# Altium project Nova_34.PrjPcb
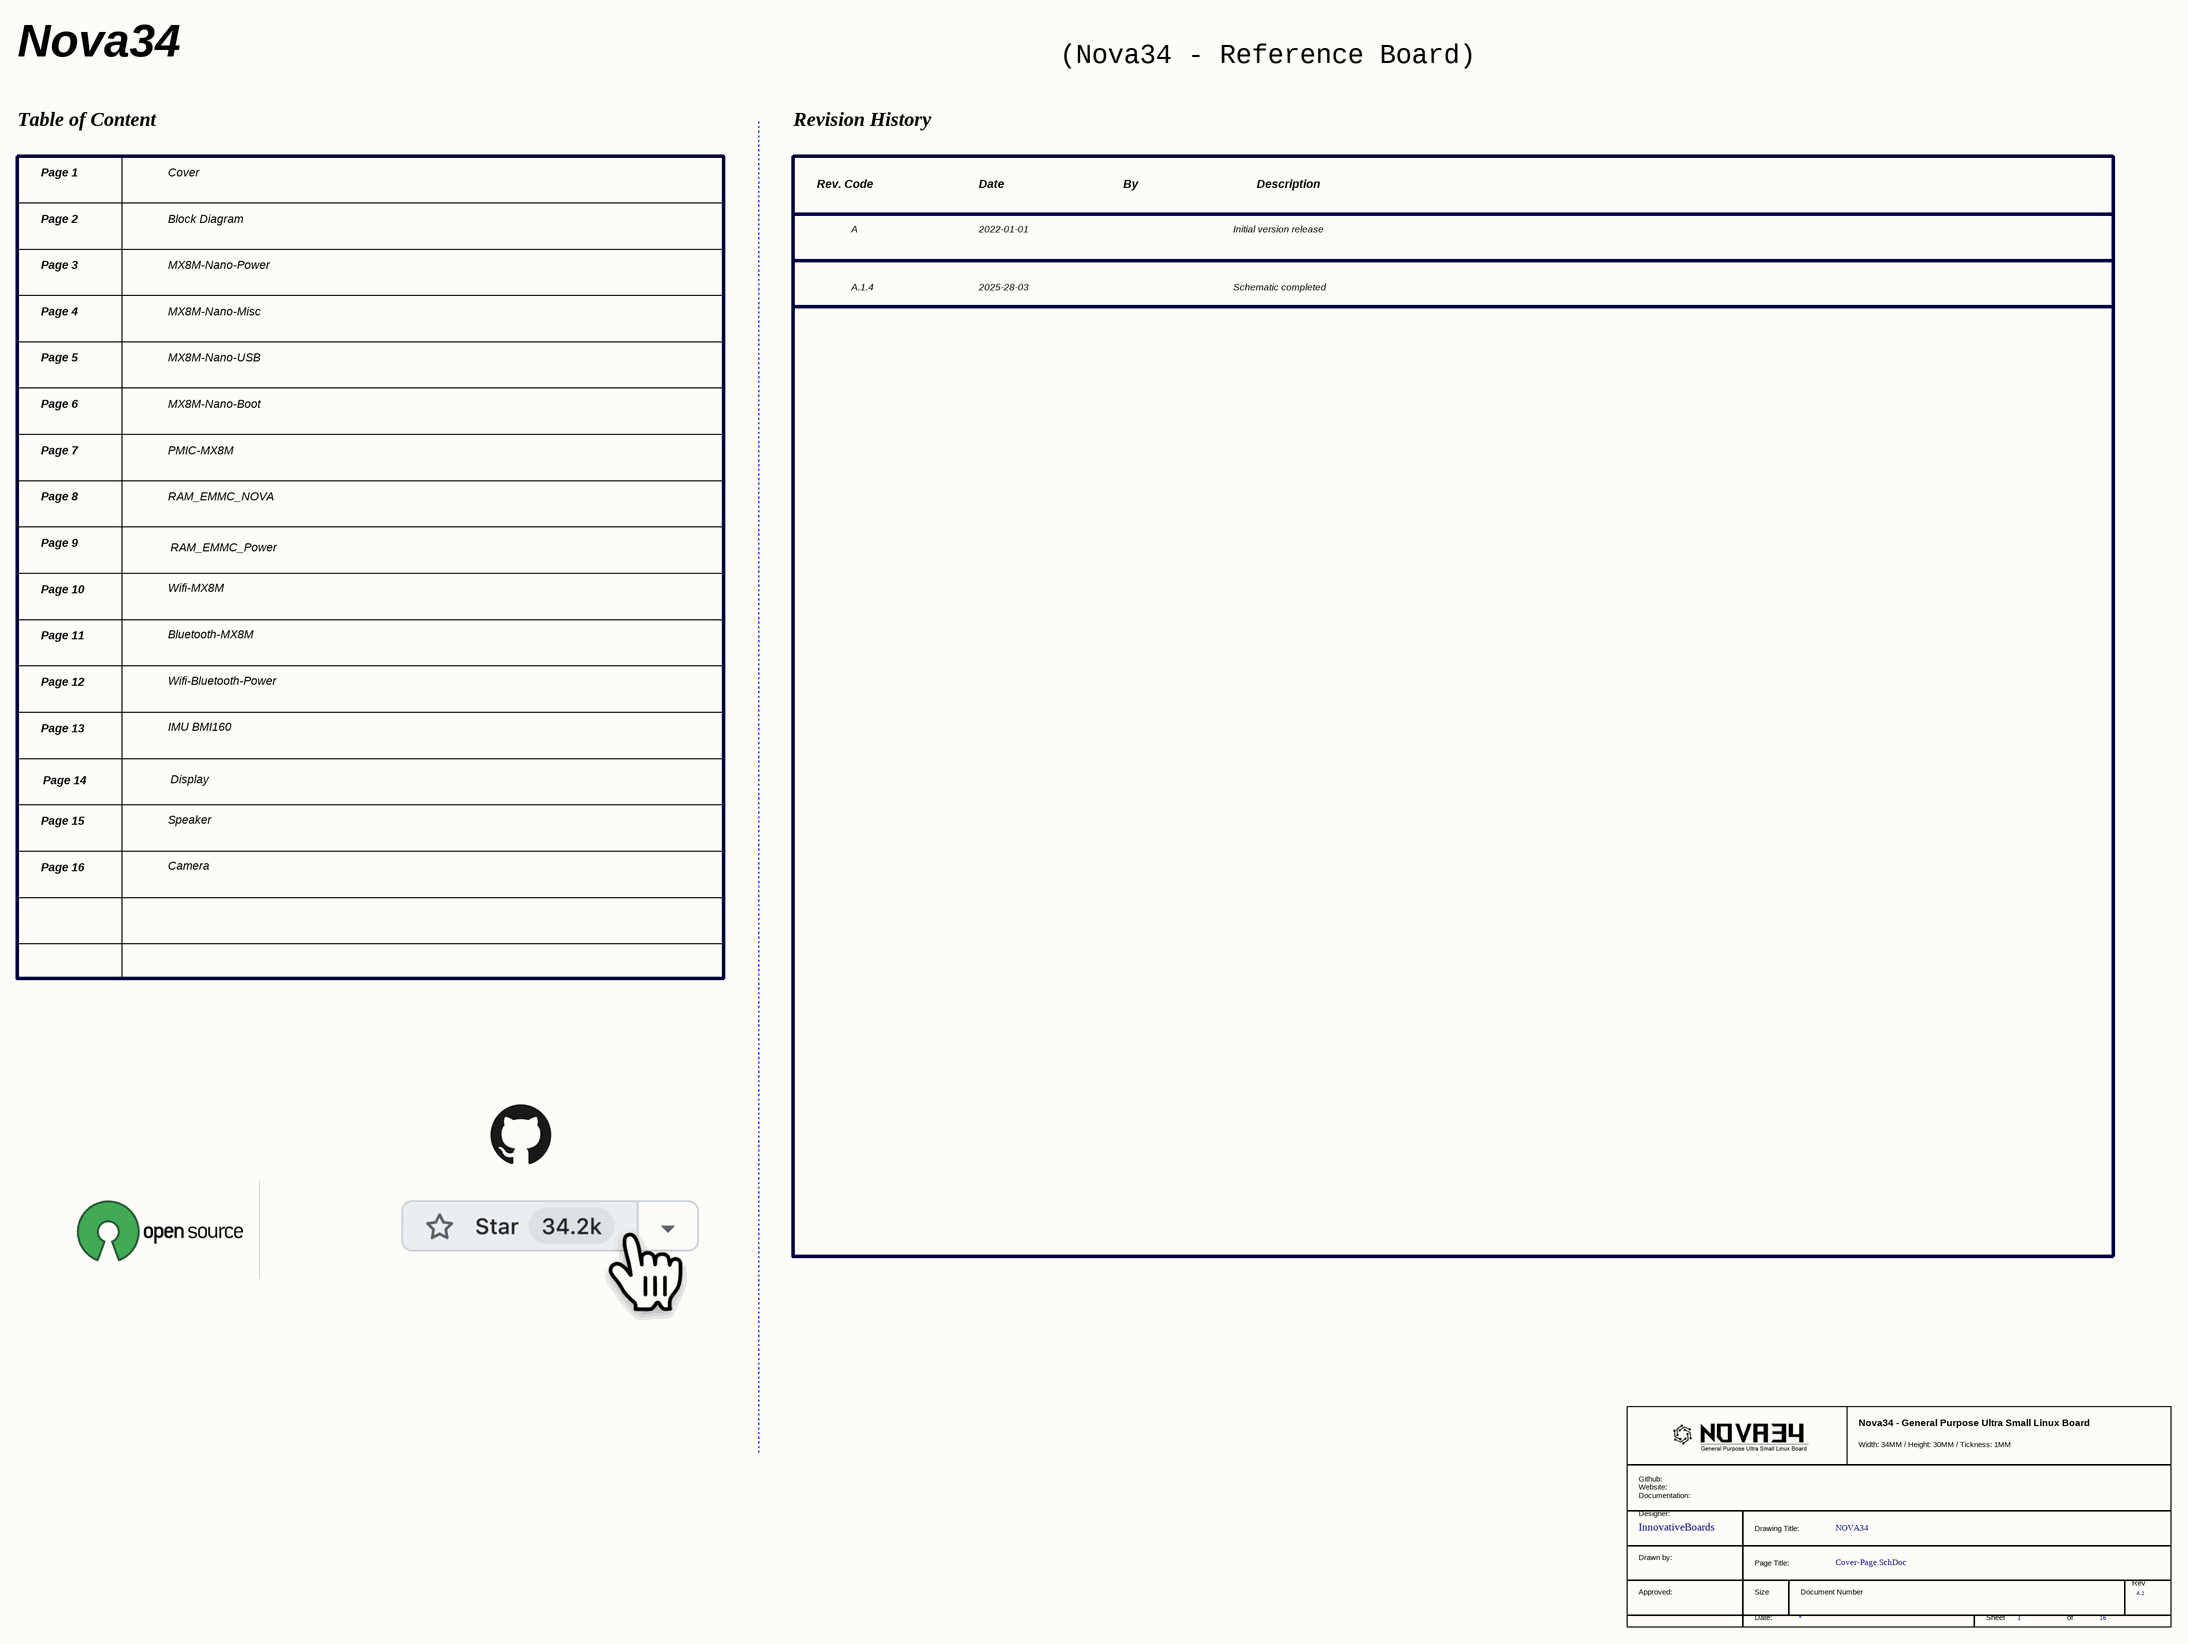
[diagram p0: Cover-Page.SchDoc]
6 sheets, 73 parts. Net scope: global (net labels, ports and power ports of the same name join across sheets).
Board file: Nova_PCB_Prod.PcbDoc
Sheets:
  Cover-Page.SchDoc
  MX8M-Nano-USB.SchDoc
  PMIC-MX8M.SchDoc
  RAM_EMMC_NOVA.SchDoc
  Wifi-MX8M.SchDoc
  Wifi-Bluetooth-Power.SchDoc

## Sheet Cover-Page.SchDoc
size C; SheetNumber: 1; SheetTotal: 16

### Parts
(Parts that share a designator on the sheet are numbered #1, #2 ... from top to bottom, then left to right.)
*#1  RevCode: A.2  (hidden comment: TitleBlock_MCPG)  (graphical)

### Notes on the sheet
- Nova34
- (Nova34 - Reference Board)
- Table of Content
- Page 1
- Cover
- Revision History
- Page 2
- Block Diagram
- Rev. Code
- A
- Date
- 2022-01-01
- By
- Initial version release
- Description
- Page 3
- MX8M-Nano-Power
- A.1.4
- 2025-28-03
- Schematic completed
- Page 4
- MX8M-Nano-Misc
- Page 5
- Page 6
- MX8M-Nano-USB
- MX8M-Nano-Boot
- Page 7
- PMIC-MX8M
- Page 8
- RAM_EMMC_NOVA
- Page 9
- RAM_EMMC_Power
- Page 10
- Page 11
- Wifi-MX8M
- Bluetooth-MX8M
- Page 12
- Wifi-Bluetooth-Power
- Page 13
- IMU BMI160
- Page 14
- Display
- Page 15
- Page 16
- Speaker
- Camera
- (in symbol TitleBlock_MCPG) Nova34 - General Purpose Ultra Small Linux Board; Width: 34MM / Height: 30MM / Tickness: 1MM; Github: / Website: / Documentation:; Designer:; InnovativeBoards; Drawing Title:; NOVA34; Drawn by:; Page Title:; Rev; Approved:; Size; Document Number; Date:; Sheet; of

### Library data of the parts
*#1 = TitleBlock_MCPG: Page Create Date: March  8, 1995

## Sheet MX8M-Nano-USB.SchDoc
size A; SheetNumber: 5; SheetTotal: 15
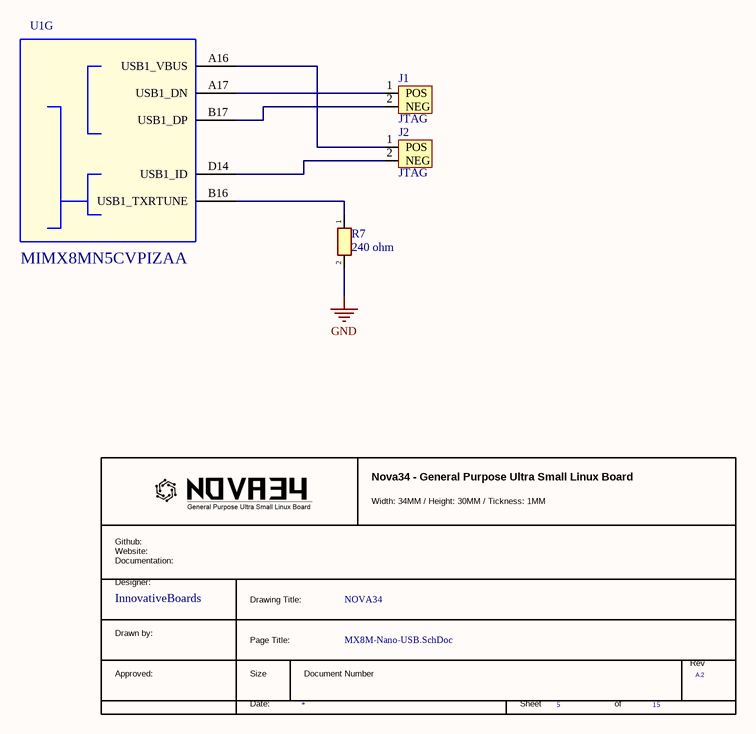
[diagram p1: MX8M-Nano-USB.SchDoc]

### Parts
(Parts that share a designator on the sheet are numbered #1, #2 ... from top to bottom, then left to right.)
*#2  RevCode: A.2  (hidden comment: TitleBlock_MCPG)  (graphical)
J1  JTAG  [JTAG]
J2  JTAG  [JTAG]
R7  240 ohm  [RESC0603X26N]
U1  MIMX8MN5CVPIZAA  [BGA306C50P21X21_1100X1100X101]  (part G of 12)

### Nets
GND: R7.2
NetJ1_1: J1.1(POS) U1.A17(USB1_DN)
NetJ1_2: J1.2(NEG) U1.B17(USB1_DP)
NetJ2_1: J2.1(POS) U1.A16(USB1_VBUS)
NetJ2_2: J2.2(NEG) U1.D14(USB1_ID)
NetR7_1: R7.1 U1.B16(USB1_TXRTUNE)

### Notes on the sheet
- (in symbol TitleBlock_MCPG) Nova34 - General Purpose Ultra Small Linux Board; Width: 34MM / Height: 30MM / Tickness: 1MM; Github: / Website: / Documentation:; Designer:; InnovativeBoards; Drawing Title:; NOVA34; Drawn by:; Page Title:; Rev; Approved:; Size; Document Number; Date:; Sheet; of

### Library data of the parts
R7 = RC0201FR-07240RL: Resistor; Manufacturer_Name: KEMET; Datasheet Link: http://www.yageo.com/documents/recent/PYu-RC0201_51_RoHS_L_8.pdf; Height: 0.26mm; Manufacturer_Part_Number: RC0201FR-07240RL; Mouser Part Number: 603-RC0201FR-07240RL; Mouser Price/Stock: http://www.mouser.com/Search/ProductDetail.aspx?qs=qUsL5DZkYVqW175bPUdS2w%3d%3d; Arrow Part Number: RC0201FR-07240RL; Arrow Price/Stock: https://www.arrow.com/en/products/rc0201fr-07240rl/yageo
U1 = MIMX8MN: IC CPU QUAD CORTEX A53+M7 1.4GHZ -- BGA306; PCB Footprint: pbga306_0p5_sq11mm; AGILE_PN: TMP-CIP-5098; CAD_APPROVED: Yes; PRE_APN: 330-77152; Temp Range: -40¡ãC to 105¡ãC; MFG_NAME01: NXP SEMICONDUCTORS; CLASS: IC; HEIGHT: 1.01MM; ROHS: Yes; MFG_PN01: MIMX8MN5CVPIZAA
*#2 = TitleBlock_MCPG: Page Create Date: March  8, 1995

## Sheet PMIC-MX8M.SchDoc
size A2; SheetNumber: 7; SheetTotal: 15
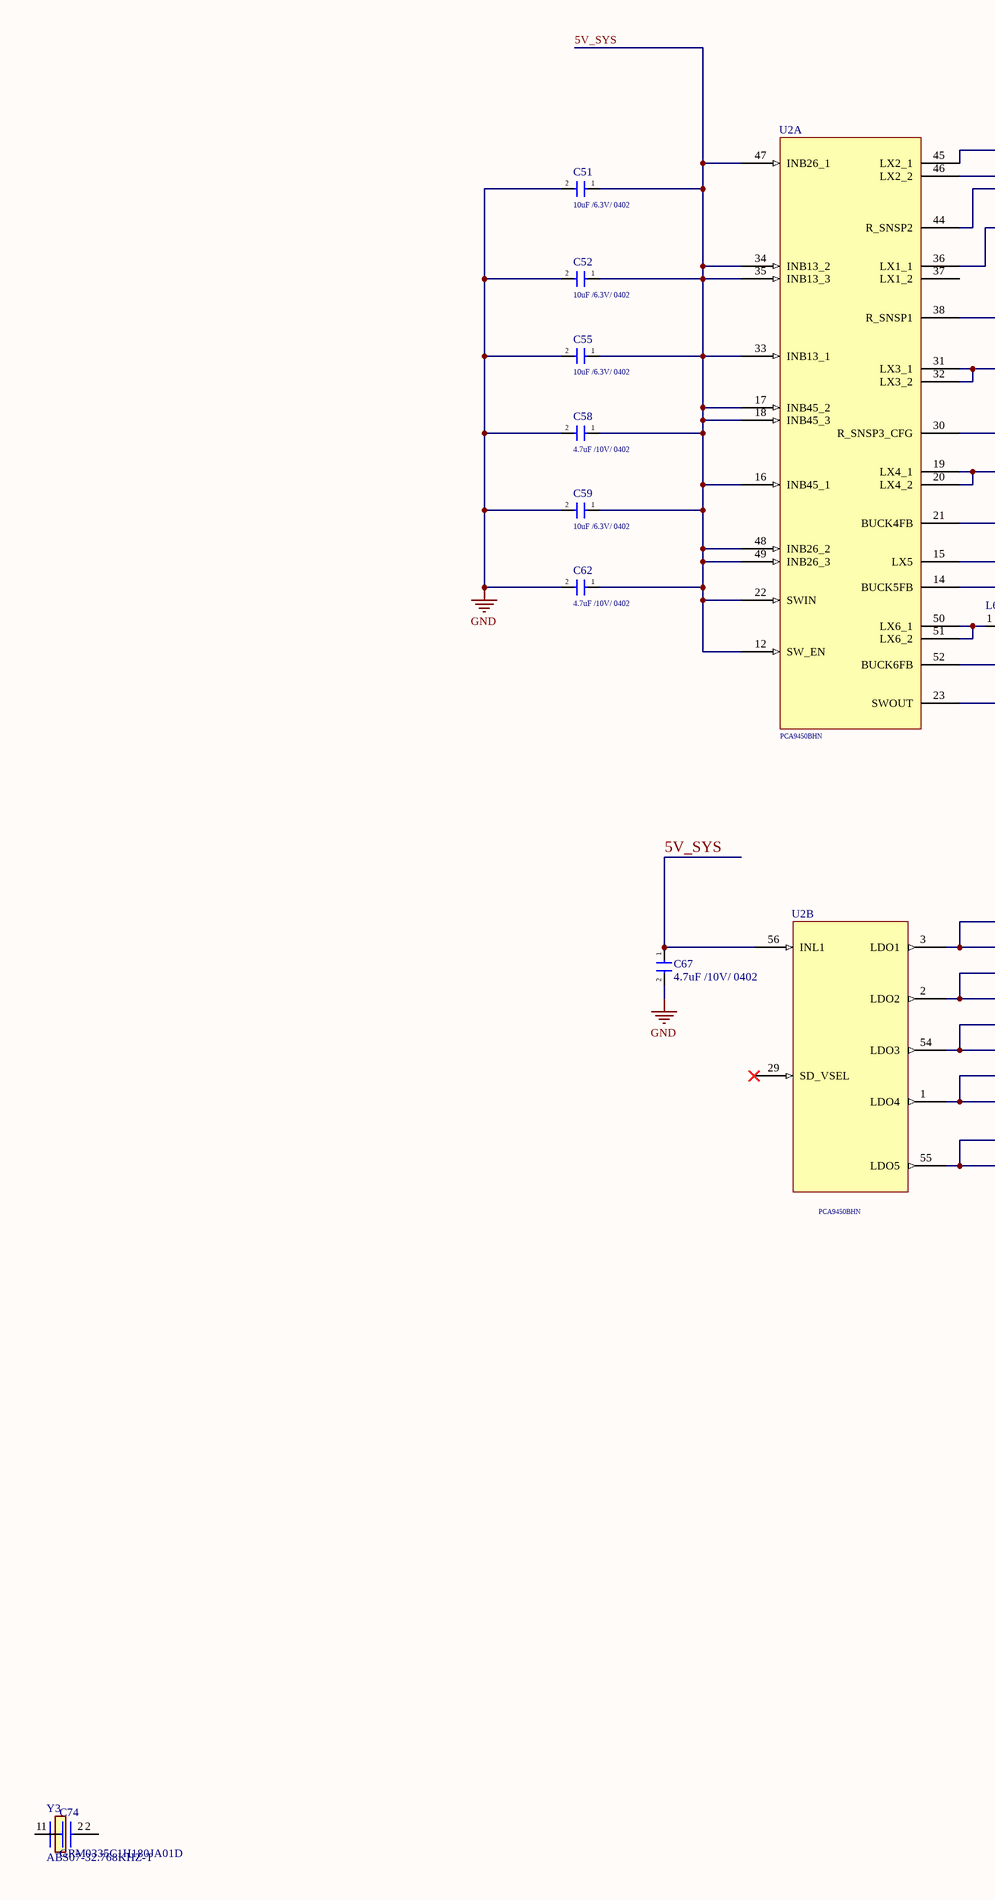
[diagram p2: PMIC-MX8M.SchDoc, left]
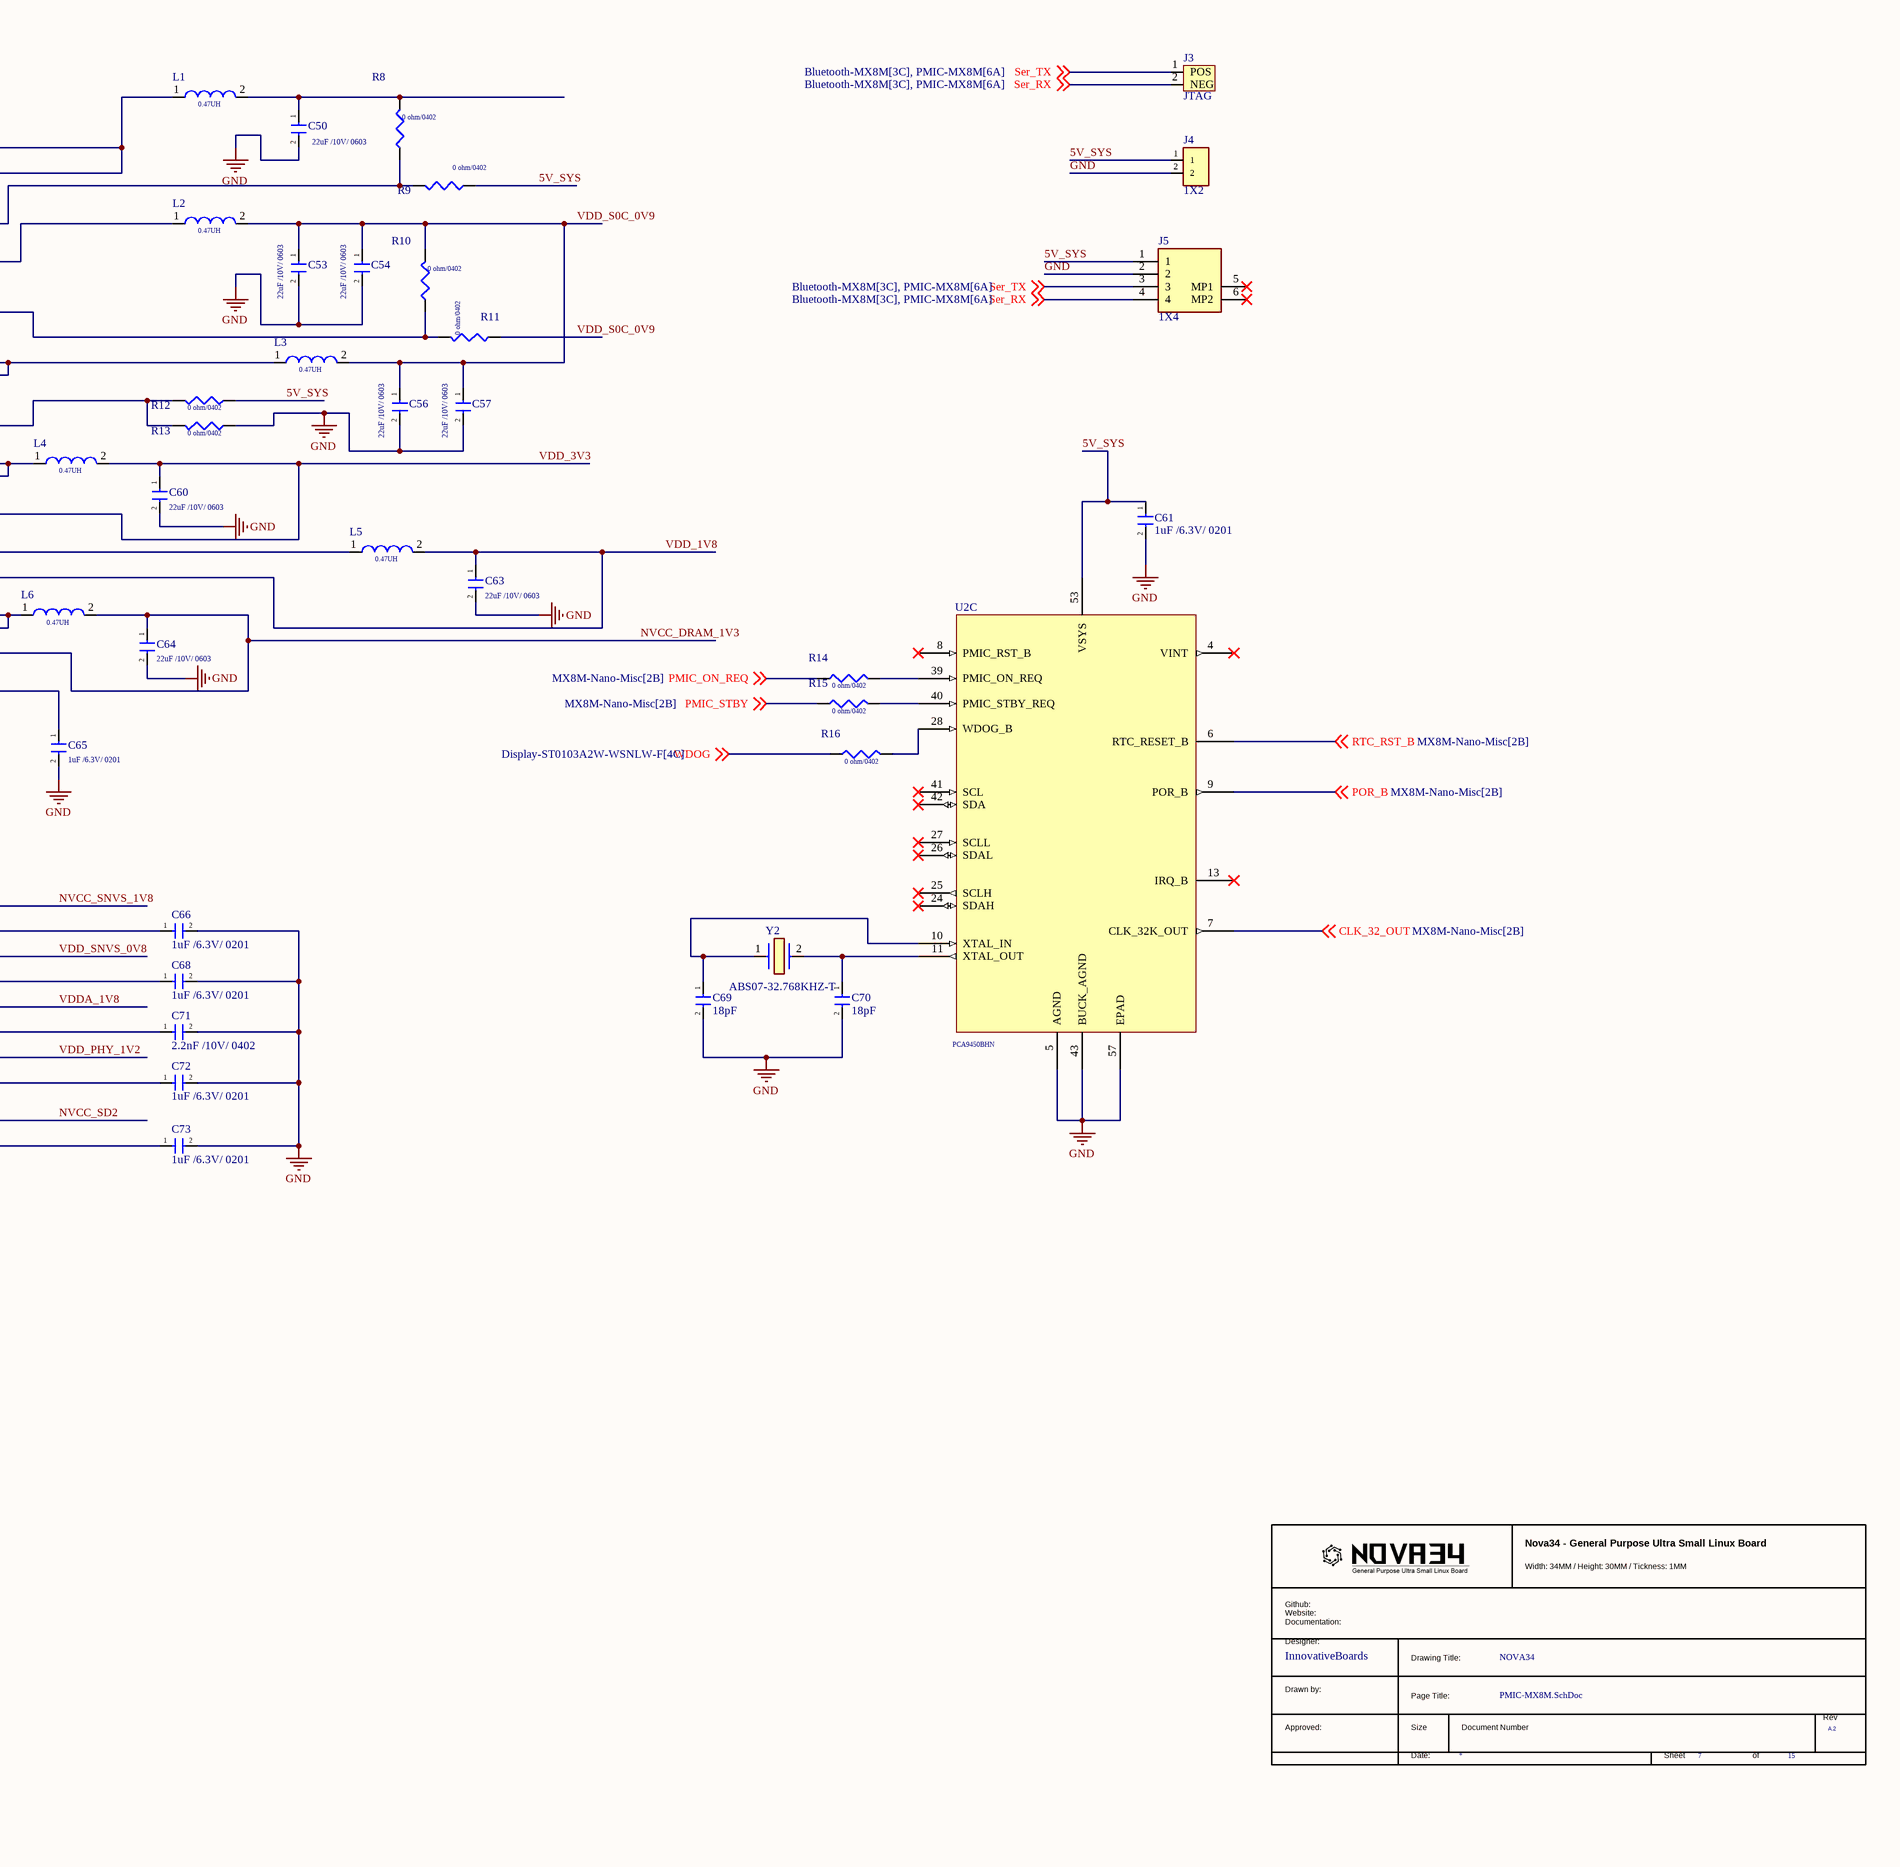
[diagram p3: PMIC-MX8M.SchDoc, right]

### Parts
(Parts that share a designator on the sheet are numbered #1, #2 ... from top to bottom, then left to right.)
*#3  RevCode: A.2  (hidden comment: TitleBlock_MCPG)  (graphical)
C50  22uF /10V/ 0603  [GRM18x]
C51  10uF /6.3V/ 0402  [CAPC1005X65N]
C52  10uF /6.3V/ 0402  [CAPC1005X65N]
C53  22uF /10V/ 0603  [GRM18x]
C54  22uF /10V/ 0603  [GRM18x]
C55  10uF /6.3V/ 0402  [CAPC1005X65N]
C56  22uF /10V/ 0603  [GRM18x]
C57  22uF /10V/ 0603  [GRM18x]
C58  4.7uF /10V/ 0402  [CAPC1005X70N]
C59  10uF /6.3V/ 0402  [CAPC1005X65N]
C60  22uF /10V/ 0603  [GRM18x]
C61  1uF /6.3V/ 0201  [GRM033D70J224ME01D]
C62  4.7uF /10V/ 0402  [CAPC1005X70N]
C63  22uF /10V/ 0603  [GRM18x]
C64  22uF /10V/ 0603  [GRM18x]
C65  1uF /6.3V/ 0201  [GRM033D70J224ME01D]
C66  1uF /6.3V/ 0201  [GRM033D70J224ME01D]
C67  4.7uF /10V/ 0402  [CAPC1005X70N]
C68  1uF /6.3V/ 0201  [GRM033D70J224ME01D]
C69  18pF  [CAPC0603X33N]
C70  18pF  [CAPC0603X33N]
C71  2.2nF /10V/ 0402  [CAPC1005X70N]
C72  1uF /6.3V/ 0201  [GRM033D70J224ME01D]
C73  1uF /6.3V/ 0201  [GRM033D70J224ME01D]
C74  GRM0335C1H180JA01D  [CAPC0603X33N]
J3  JTAG  [JTAG]
J4  1X2  [HDRV2W64P0X254_1X2_508X254X838P]
J5  1X4  [B4BZRSM4TFLFSN]
L1  0.47UH  [IND_SPH2520]
L2  0.47UH  [IND_SPH2520]
L3  0.47UH  [IND_SPH2520]
L4  0.47UH  [IND_SPH2520]
L5  0.47UH  [IND_SPH2520]
L6  0.47UH  [IND_SPH2520]
R8  0 ohm/0402  [RES_0402]
R9  0 ohm/0402  [RES_0402]
R10  0 ohm/0402  [RES_0402]
R11  0 ohm/0402  [RES_0402]
R12  0 ohm/0402  [RES_0402]
R13  0 ohm/0402  [RES_0402]
R14  0 ohm/0402  [RES_0402]
R15  0 ohm/0402  [RES_0402]
R16  0 ohm/0402  [RES_0402]
U2  PCA9450BHN  [QFN40P700X700X100-57N-D]  (parts A,B,C of 3)
Y2  ABS07-32.768KHZ-T  [ABS07]
Y3  ABS07-32.768KHZ-T  [ABS07]

### Nets
GND: C50.2 C51.2 C52.2 C53.2 C54.2 C55.2 C56.2 C57.2 C58.2 C59.2 C60.2 C61.2 C62.2 C63.2 C64.2 C65.2 C66.2 C67.2 C68.2 C69.2 C70.2 C71.2 C72.2 C73.2 J4.2 J5.2 R13.1 U2.5(AGND) U2.43(BUCK_AGND) U2.57(EPAD)
5V_SYS: C51.1 C52.1 C55.1 C58.1 C59.1 C61.1 C62.1 C67.1 J4.1 J5.1 R9.1 R12.1 U2.12(SW_EN) U2.16(INB45_1) U2.17(INB45_2) U2.18(INB45_3) U2.22(SWIN) U2.33(INB13_1) U2.34(INB13_2) U2.35(INB13_3) U2.47(INB26_1) U2.48(INB26_2) U2.49(INB26_3) U2.53(VSYS) U2.56(INL1)
CLK_32_OUT: U2.7(CLK_32K_OUT) ; off-sheet CLK_32_OUT
NVCC_DRAM_1V3: C64.1 L6.2 U2.52(BUCK6FB)
NVCC_SD2: C73.1 U2.55(LDO5)
NVCC_SNVS_1V8: C66.1 U2.3(LDO1)
PMIC_ON_REQ: R14.1 ; off-sheet PMIC_ON_REQ
PMIC_STBY: R15.1 ; off-sheet PMIC_STBY
POR_B: U2.9(POR_B) ; off-sheet POR_B
RTC_RST_B: U2.6(RTC_RESET_B) ; off-sheet RTC_RST_B
Ser_RX: J3.2(NEG) J5.4 ; off-sheet Ser_RX
Ser_TX: J3.1(POS) J5.3 ; off-sheet Ser_TX
VDD_1V8: C63.1 L5.2 U2.14(BUCK5FB)
VDD_3V3: C60.1 L4.2 U2.21(BUCK4FB)
VDD_PHY_1V2: C72.1 U2.1(LDO4)
VDD_S0C_0V9: C53.1 C54.1 C56.1 C57.1 L2.2 L3.2 R10.2 R11.1
VDD_SNVS_0V8: C68.1 U2.2(LDO2)
VDDA_1V8: C71.1 U2.54(LDO3)
WDOG: R16.1 ; off-sheet WDOG
NetC50_1: C50.1 L1.2 R8.2
NetC65_1: C65.1 U2.23(SWOUT)
NetC69_1: C69.1 U2.10(XTAL_IN) Y2.1
NetC70_1: C70.1 U2.11(XTAL_OUT) Y2.2
NetC74_1: C74.1 Y3.1
NetL1_1: L1.1 U2.45(LX2_1) U2.46(LX2_2)
NetL2_1: L2.1 U2.36(LX1_1)
NetL3_1: L3.1 U2.31(LX3_1) U2.32(LX3_2)
NetL4_1: L4.1 U2.19(LX4_1) U2.20(LX4_2)
NetL5_1: L5.1 U2.15(LX5)
NetL6_1: L6.1 U2.50(LX6_1) U2.51(LX6_2)
NetR8_1: R8.1 R9.2 U2.44(R_SNSP2)
NetR10_1: R10.1 R11.2 U2.38(R_SNSP1)
NetR12_2: R12.2 R13.2 U2.30(R_SNSP3_CFG)
NetR14_2: R14.2 U2.39(PMIC_ON_REQ)
NetR15_2: R15.2 U2.40(PMIC_STBY_REQ)
NetR16_2: R16.2 U2.28(WDOG_B)

Not connected (* = marked no-connect by the designer): C74 2; J5 5(MP1)* 6(MP2)*; U2 4(VINT)* 8(PMIC_RST_B)* 13(IRQ_B)* 24(SDAH)* 25(SCLH)* 26(SDAL)* 27(SCLL)* 29(SD_VSEL)* 37(LX1_2) 41(SCL)* 42(SDA)*; Y3 2

### Notes on the sheet
- (in symbol TitleBlock_MCPG) Nova34 - General Purpose Ultra Small Linux Board; Width: 34MM / Height: 30MM / Tickness: 1MM; Github: / Website: / Documentation:; Designer:; InnovativeBoards; Drawing Title:; NOVA34; Drawn by:; Page Title:; Rev; Approved:; Size; Document Number; Date:; Sheet; of

### Library data of the parts
C50 C53 C54 C56 C57 C60 C63 C64 = GRM187R61A226ME15D: Multilayer Ceramic Capacitors MLCC - SMD/SMT 22 uF 10 VDC 20% 0603 X5R; Manufacturer_Name: Murata Electronics; Datasheet Link: https://search.murata.co.jp/Ceramy/image/img/A01X/G101/ENG/GRM187R61A226ME15-01A.pdf; Height: 0.9mm; Manufacturer_Part_Number: GRM187R61A226ME15D; Mouser Part Number: 81-GRM187R61A226ME5D; Mouser Price/Stock: https://www.mouser.co.uk/ProductDetail/Murata-Electronics/GRM187R61A226ME15D?qs=I53XXhTNm8uUaeh8Eawx4Q%3D%3D; Arrow Part Number: GRM187R61A226ME15D; Arrow Price/Stock: https://www.arrow.com/en/products/grm187r61a226me15d/murata-manufacturing?region=nac
C51 C52 C55 C59 = GRM155R60J106ME15D: Multilayer Ceramic Capacitors MLCC - SMD/SMT 10 uF 6.3 VDC 20% 0402 X5R; Manufacturer_Name: Murata Electronics; Datasheet Link: https://search.murata.co.jp/Ceramy/image/img/A01X/G101/ENG/GRM155R60J106ME15-01A.pdf; Height: 0.65mm; Manufacturer_Part_Number: GRM155R60J106ME15D; Mouser Part Number: 81-GRM155R60J106ME5D; Mouser Price/Stock: https://www.mouser.co.uk/ProductDetail/Murata-Electronics/GRM155R60J106ME15D?qs=I53XXhTNm8s65u6%252BR3mHqw%3D%3D; Arrow Part Number: GRM155R60J106ME15D; Arrow Price/Stock: https://www.arrow.com/en/products/grm155r60j106me15d/murata-manufacturing?region=nac
C58 C62 C67 = GRT155C81A475ME13J: Multilayer Ceramic Capacitors MLCC - SMD/SMT 0402 X6S 4.7 F 20 10VDC AEC-Q200; Manufacturer_Name: Murata Electronics; Datasheet Link: https://search.murata.co.jp/Ceramy/image/img/A01X/G101/ENG/GRT155C81A475ME13-01A.pdf; Height: 0.7mm; Manufacturer_Part_Number: GRT155C81A475ME13J; Mouser Part Number: 81-GRT155C81A475ME3J; Mouser Price/Stock: https://www.mouser.co.uk/ProductDetail/Murata-Electronics/GRT155C81A475ME13J?qs=ufv2HEpFn%252BS%252BPUDm1eQCHw%3D%3D
C61 C65 C66 C68 C72 C73 = GRM033C80J105ME05J: Multilayer Ceramic Capacitors MLCC - SMD/SMT 1 uF 6.3 VDC 20% 0201 X6S; Manufacturer_Name: Murata Electronics; Datasheet Link: https://search.murata.co.jp/Ceramy/image/img/A01X/G101/ENG/GRM033C80J105ME05-01A.pdf; Height: 0.33mm; Manufacturer_Part_Number: GRM033C80J105ME05J; Mouser Part Number: 81-GRM033C80J105ME5J; Mouser Price/Stock: https://www.mouser.co.uk/ProductDetail/Murata-Electronics/GRM033C80J105ME05J?qs=5aG0NVq1C4we89LuRh7HJA%3D%3D; Arrow Part Number: GRM033C80J105ME05J; Arrow Price/Stock: https://www.arrow.com/en/products/grm033c80j105me05j/murata-manufacturing?region=nac
C69 C70 C74 = GRM0335C1H180JA01D: Capacitor; Manufacturer_Name: Murata Electronics; Datasheet Link: https://search.murata.co.jp/Ceramy/image/img/A01X/G101/ENG/GRM0335C1H180JA01-01A.pdf; Height: 0.33mm; Manufacturer_Part_Number: GRM0335C1H180JA01D; Mouser Part Number: 81-GRM0335C1H180JA1D; Mouser Price/Stock: https://www.mouser.co.uk/ProductDetail/Murata-Electronics/GRM0335C1H180JA01D?qs=lsk7mV%2FgRRLtYG1v2rvE9A%3D%3D; Arrow Part Number: GRM0335C1H180JA01D; Arrow Price/Stock: https://www.arrow.com/en/products/grm0335c1h180ja01d/murata-manufacturing
C71 = GRM155R61A222KA01D: Multilayer Ceramic Capacitors MLCC - SMD/SMT 2200 pF 10 VDC 10% 0402 X5R; Manufacturer_Name: Murata Electronics; Datasheet Link: https://search.murata.co.jp/Ceramy/image/img/A01X/G101/ENG/GRM155R61A222KA01-01A.pdf; Height: 0.7mm; Manufacturer_Part_Number: GRM155R61A222KA01D; Mouser Part Number: 81-GRM155R61A222KA1D; Mouser Price/Stock: https://www.mouser.co.uk/ProductDetail/Murata-Electronics/GRM155R61A222KA01D?qs=y02iAgv9n60wExGWvVZZNg%3D%3D
J4 = TSW-102-07-G-S-002: Connector; Manufacturer_Name: SAMTEC; Datasheet Link: http://suddendocs.samtec.com/prints/tsw-xxx-xx-xxx-x-xx-xxx-mkt.pdf; Height: 8.38mm; Manufacturer_Part_Number: TSW-102-07-G-S-002; Mouser Part Number: 200-TSW-10207GS002; Mouser Price/Stock: https://www.mouser.co.uk/ProductDetail/Samtec/TSW-102-07-G-S-002?qs=icabnvfcbsHvpvHCodBv1Q%3D%3D; Arrow Part Number: TSW-102-07-G-S-002; Arrow Price/Stock: https://www.arrow.com/en/products/tsw-102-07-g-s-002/samtec?region=nac
J5 = B4B-ZR-SM4-TF_LF__SN_: Connector; Manufacturer_Name: JST (JAPAN SOLDERLESS TERMINALS); Manufacturer_Part_Number: B4B-ZR-SM4-TF(LF)(SN); Datasheet Link: http://www.jst-mfg.com/product/pdf/eng/eZH.pdf; Height: 5mm; Mouser Part Number: N/A; Mouser Price/Stock: https://www.mouser.co.uk/ProductDetail/JST-Commercial/B4B-ZR-SM4-TFLFSN?qs=IKkN%2F947nfC%2FbT9OqR9GjQ%3D%3D; Arrow Part Number: B4B-ZR-SM4-TF(LF)(SN); Arrow Price/Stock: https://www.arrow.com/en/products/b4b-zr-sm4-tf-lf-sn/jst-manufacturing?region=europe
L1-L6 = WPN252012ER47MT: 470 nH Shielded Drum Core, Wirewound Inductor 4.1 A 32mOhm Max 1008 (2520 Metric); PART_TYPE: INDUCTOR\POWER; CLASS: DISCRETE; Temp Range: -40¡ãC to +125¡ãC; CAD_APPROVED: Yes; MFG_NAME01: SHENZHEN SUNLORD ELECTRONICS CO., LTD; TOL: 20%; AGILE_PN: 180-78647; HEIGHT: 1.2MM; Temp_Range: -40¡ãC to +125¡ãC; ROHS: Yes; MFG_PN01: WPN252012ER47MT; Tolerance: 20%; PCB Footprint: ind_sph2520
R8-R16 = RC0402JR-070RL: RES MF ZERO OHM 1/16W 5% 0402; CLASS: DISCRETE; AGILE_PN: 470-75394; MFG_NAME01: YAGEO AMERICA; CAD_APPROVED: Yes; FPLIST: RC0402_25,RC0402_HD,RC0402_X2,0402_CC; PCB Footprint: 0402_CC; Tolerance: 5%; MFG_PN01: RC0402JR-070RL; ROHS: Yes; HEIGHT: 0.45 MM; VOLTAGE: 1/16W
U2 = PCA9450_HVQFN56P_A: IC POWER MANAGEMENT 2.7-5.5V HVQFN56; SPLIT_INST: TRUE; SWAP_INFO: (S1+S2+S3); CAD_APPROVED: Yes; PRE_APN: 315-82314; Temp_Range: -40C to +105C; MFG_NAME01: NXP SEMICONDUCTORS; AGILE_PN: TMP-WF-36197; PCB Footprint: hvqfn56_0p4_7x7_ep4p7mm; CLASS: IC; HEIGHT: 1MM; ROHS: Yes; MFG_PN01: PCA9450BHN; VOLTAGE: 2.7-5.5V; Temp Range: -40C to +105C
Y2 Y3 = ABS07-32.768KHZ-T: Crystal or Oscillator; Manufacturer_Name: ABRACON; Datasheet Link: https://abracon.com/Resonators/ABS07.pdf; Height: 0.9mm; Manufacturer_Part_Number: ABS07-32.768KHZ-T; Mouser Part Number: 815-ABS07-32.768KHZT; Mouser Price/Stock: https://www.mouser.co.uk/ProductDetail/ABRACON/ABS07-32.768KHZ-T?qs=3SpAxaLJ01g8GJWeO3sA3Q%3D%3D; Arrow Part Number: ABS07-32.768KHZ-T; Arrow Price/Stock: https://www.arrow.com/en/products/abs07-32.768khz-t/abracon?utm_currency=USD&region=europe
*#3 = TitleBlock_MCPG: Page Create Date: March  8, 1995

## Sheet RAM_EMMC_NOVA.SchDoc
size A3; SheetNumber: 8; SheetTotal: 15
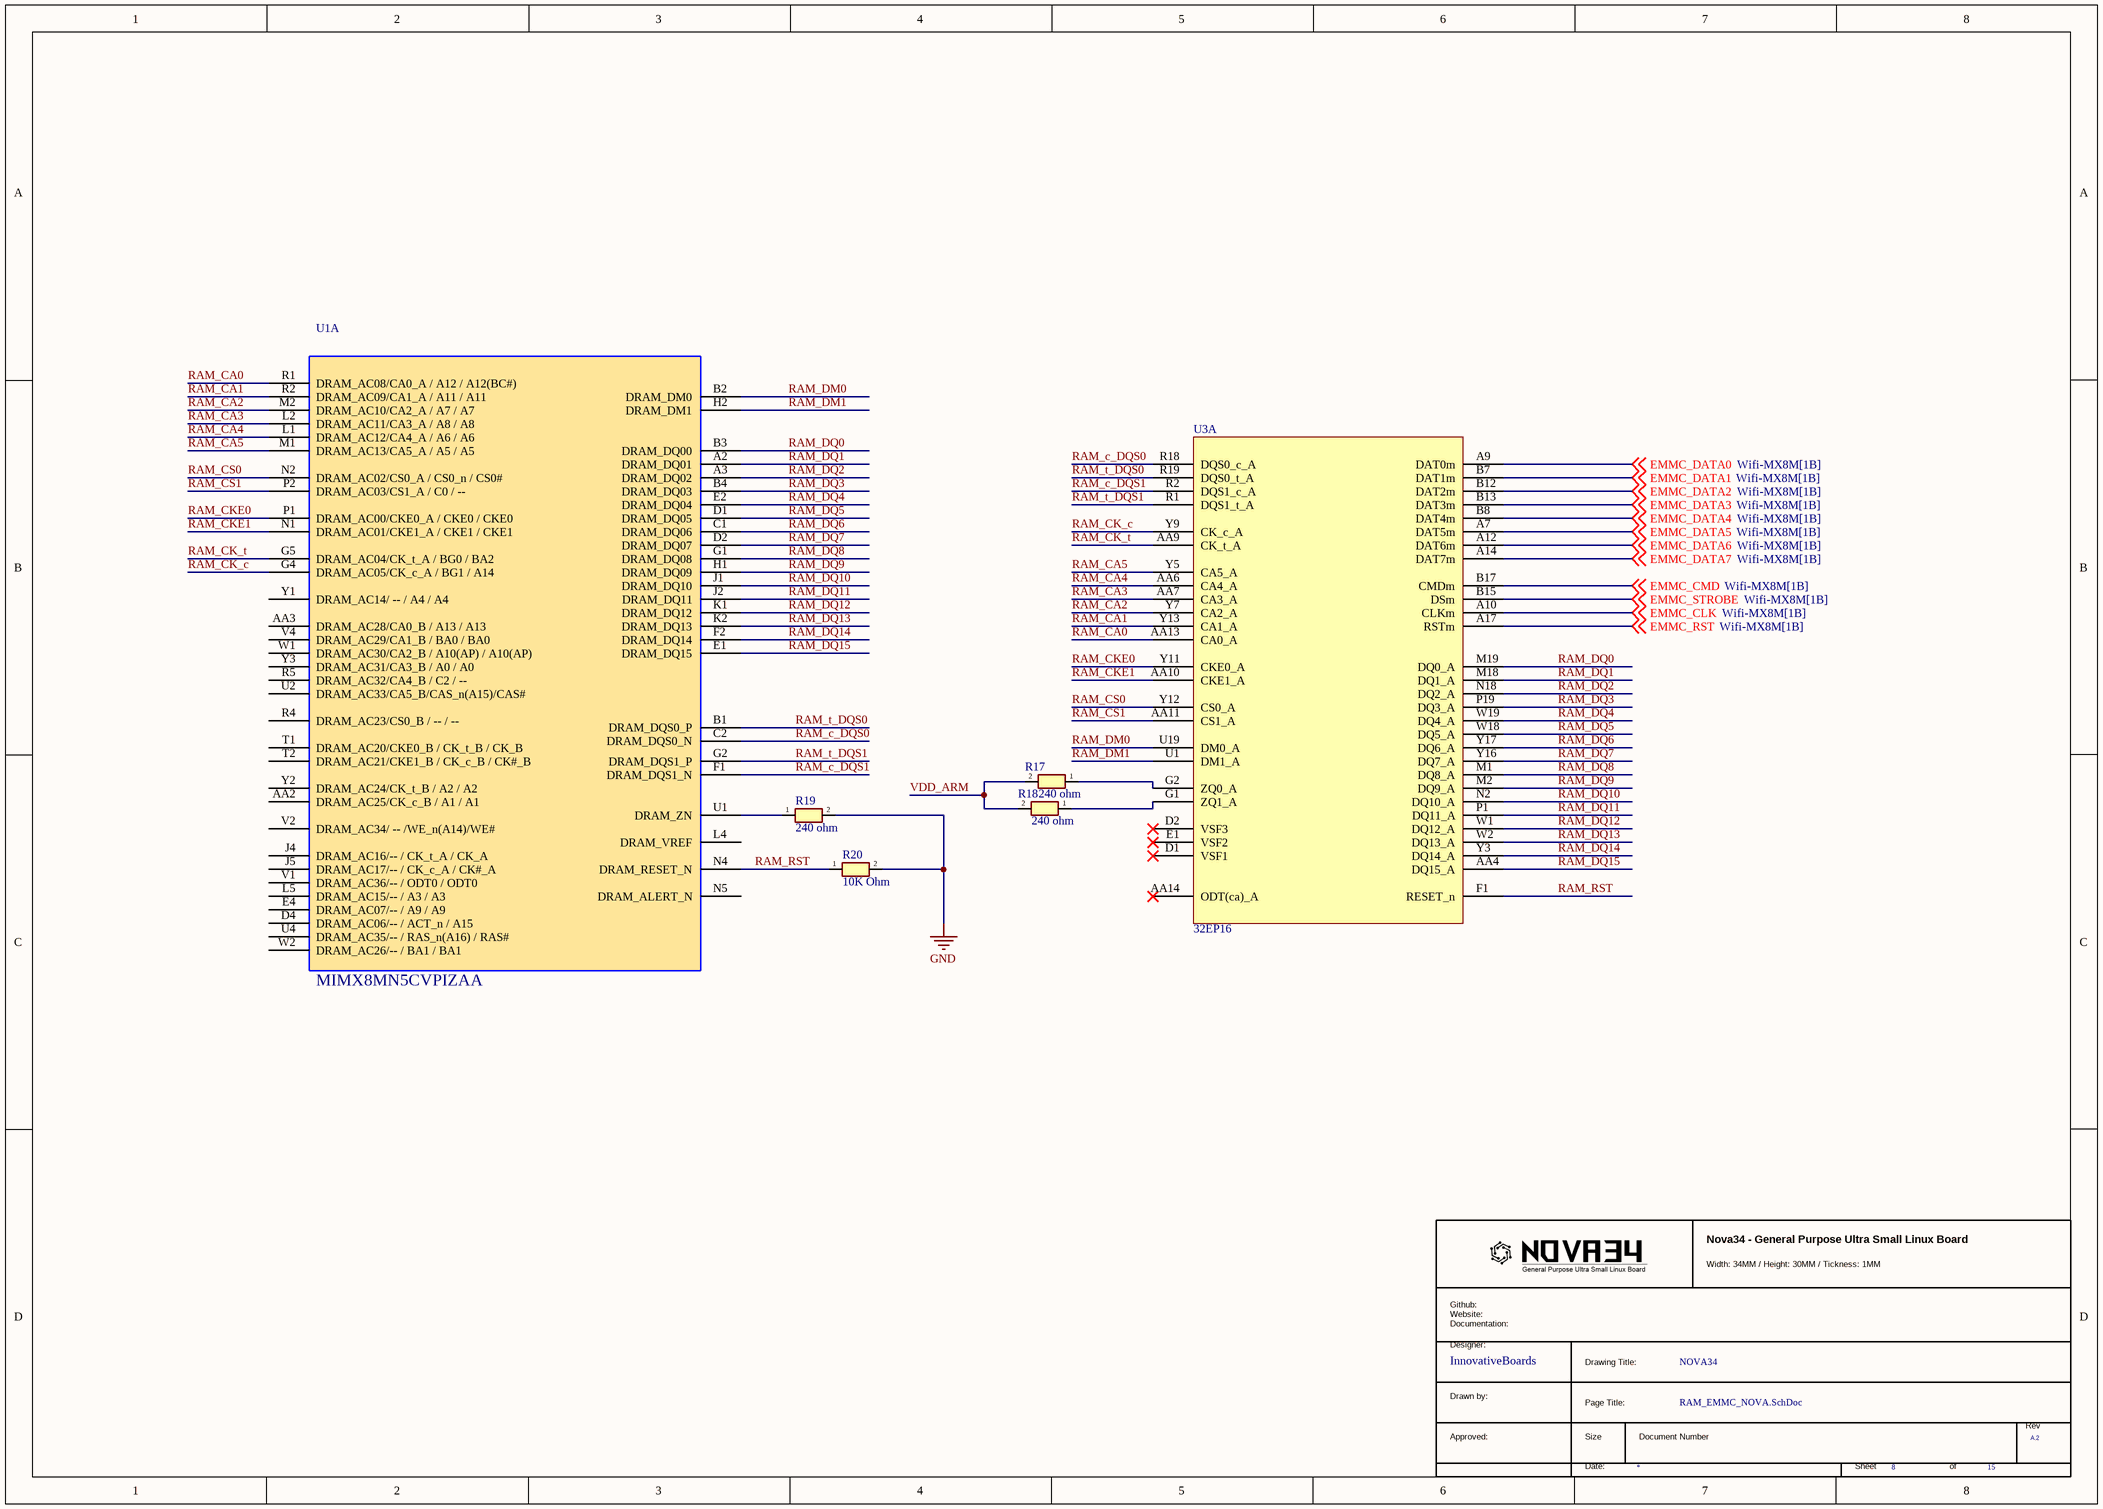
[diagram p4: RAM_EMMC_NOVA.SchDoc]

### Parts
(Parts that share a designator on the sheet are numbered #1, #2 ... from top to bottom, then left to right.)
*#4  RevCode: A.2  (hidden comment: TitleBlock_MCPG)  (graphical)
R17  240 ohm  [RESC0603X26N]
R18  240 ohm  [RESC0603X26N]
R19  240 ohm  [RESC0603X26N]
R20  10K Ohm  [RESC1005X40N]
U1  MIMX8MN5CVPIZAA  [BGA306C50P21X21_1100X1100X101]  (part A of 12)
U3  32EP16  [BGA144C40P19X21_800X950X80]  (part A of 3)

### Nets
GND: R19.2 R20.2
EMMC_CLK: U3.A10(CLKm) ; off-sheet EMMC_CLK
EMMC_CMD: U3.B17(CMDm) ; off-sheet EMMC_CMD
EMMC_DATA0: U3.A9(DAT0m) ; off-sheet EMMC_DATA0
EMMC_DATA1: U3.B7(DAT1m) ; off-sheet EMMC_DATA1
EMMC_DATA2: U3.B12(DAT2m) ; off-sheet EMMC_DATA2
EMMC_DATA3: U3.B13(DAT3m) ; off-sheet EMMC_DATA3
EMMC_DATA4: U3.B8(DAT4m) ; off-sheet EMMC_DATA4
EMMC_DATA5: U3.A7(DAT5m) ; off-sheet EMMC_DATA5
EMMC_DATA6: U3.A12(DAT6m) ; off-sheet EMMC_DATA6
EMMC_DATA7: U3.A14(DAT7m) ; off-sheet EMMC_DATA7
EMMC_RST: U3.A17(RSTm) ; off-sheet EMMC_RST
EMMC_STROBE: U3.B15(DSm) ; off-sheet EMMC_STROBE
RAM_c_DQS0: U1.C2(DRAM_DQS0_N) U3.R18(DQS0_c_A)
RAM_c_DQS1: U1.F1(DRAM_DQS1_N) U3.R2(DQS1_c_A)
RAM_CA0: U1.R1(DRAM_AC08/CA0_A_/_A12_/_A12(BC#)) U3.AA13(CA0_A)
RAM_CA1: U1.R2(DRAM_AC09/CA1_A_/_A11_/_A11) U3.Y13(CA1_A)
RAM_CA2: U1.M2(DRAM_AC10/CA2_A_/_A7_/_A7) U3.Y7(CA2_A)
RAM_CA3: U1.L2(DRAM_AC11/CA3_A_/_A8_/_A8) U3.AA7(CA3_A)
RAM_CA4: U1.L1(DRAM_AC12/CA4_A_/_A6_/_A6) U3.AA6(CA4_A)
RAM_CA5: U1.M1(DRAM_AC13/CA5_A_/_A5_/_A5) U3.Y5(CA5_A)
RAM_CK_c: U1.G4(DRAM_AC05/CK_c_A_/_BG1_/_A14) U3.Y9(CK_c_A)
RAM_CK_t: U1.G5(DRAM_AC04/CK_t_A_/_BG0_/_BA2) U3.AA9(CK_t_A)
RAM_CKE0: U1.P1(DRAM_AC00/CKE0_A_/_CKE0_/_CKE0) U3.Y11(CKE0_A)
RAM_CKE1: U1.N1(DRAM_AC01/CKE1_A_/_CKE1_/_CKE1) U3.AA10(CKE1_A)
RAM_CS0: U1.N2(DRAM_AC02/CS0_A_/_CS0_n_/_CS0#) U3.Y12(CS0_A)
RAM_CS1: U1.P2(DRAM_AC03/CS1_A_/_C0_/_--) U3.AA11(CS1_A)
RAM_DM0: U1.B2(DRAM_DM0) U3.U19(DM0_A)
RAM_DM1: U1.H2(DRAM_DM1) U3.U1(DM1_A)
RAM_DQ0: U1.B3(DRAM_DQ00) U3.M19(DQ0_A)
RAM_DQ1: U1.A2(DRAM_DQ01) U3.M18(DQ1_A)
RAM_DQ2: U1.A3(DRAM_DQ02) U3.N18(DQ2_A)
RAM_DQ3: U1.B4(DRAM_DQ03) U3.P19(DQ3_A)
RAM_DQ4: U1.E2(DRAM_DQ04) U3.W19(DQ4_A)
RAM_DQ5: U1.D1(DRAM_DQ05) U3.W18(DQ5_A)
RAM_DQ6: U1.C1(DRAM_DQ06) U3.Y17(DQ6_A)
RAM_DQ7: U1.D2(DRAM_DQ07) U3.Y16(DQ7_A)
RAM_DQ8: U1.G1(DRAM_DQ08) U3.M1(DQ8_A)
RAM_DQ9: U1.H1(DRAM_DQ09) U3.M2(DQ9_A)
RAM_DQ10: U1.J1(DRAM_DQ10) U3.N2(DQ10_A)
RAM_DQ11: U1.J2(DRAM_DQ11) U3.P1(DQ11_A)
RAM_DQ12: U1.K1(DRAM_DQ12) U3.W1(DQ12_A)
RAM_DQ13: U1.K2(DRAM_DQ13) U3.W2(DQ13_A)
RAM_DQ14: U1.F2(DRAM_DQ14) U3.Y3(DQ14_A)
RAM_DQ15: U1.E1(DRAM_DQ15) U3.AA4(DQ15_A)
RAM_RST: R20.1 U1.N4(DRAM_RESET_N) U3.F1(RESET_n)
RAM_t_DQS0: U1.B1(DRAM_DQS0_P) U3.R19(DQS0_t_A)
RAM_t_DQS1: U1.G2(DRAM_DQS1_P) U3.R1(DQS1_t_A)
VDD_ARM: R17.2 R18.2
NetR17_1: R17.1 U3.G2(ZQ0_A)
NetR18_1: R18.1 U3.G1(ZQ1_A)
NetR19_1: R19.1 U1.U1(DRAM_ZN)

Not connected (* = marked no-connect by the designer): U1 AA2(DRAM_AC25/CK_c_B_/_A1_/_A1) AA3(DRAM_AC28/CA0_B_/_A13_/_A13) D4(DRAM_AC06/--_/_ACT_n_/_A15) E4(DRAM_AC07/--_/_A9_/_A9) J4(DRAM_AC16/--_/_CK_t_A_/_CK_A) J5(DRAM_AC17/--_/_CK_c_A_/_CK#_A) L4(DRAM_VREF) L5(DRAM_AC15/--_/_A3_/_A3) N5(DRAM_ALERT_N) R4(DRAM_AC23/CS0_B_/_--_/_--) R5(DRAM_AC32/CA4_B_/_C2_/_--) T1(DRAM_AC20/CKE0_B_/_CK_t_B_/_CK_B) T2(DRAM_AC21/CKE1_B_/_CK_c_B_/_CK#_B) U2(DRAM_AC33/CA5_B/CAS_n(A15)/CAS#) U4(DRAM_AC35/--_/_RAS_n(A16)_/_RAS#) V1(DRAM_AC36/--_/_ODT0_/_ODT0) V2(DRAM_AC34/_--_/WE_n(A14)/WE#) V4(DRAM_AC29/CA1_B_/_BA0_/_BA0) W1(DRAM_AC30/CA2_B_/_A10(AP)_/_A10(AP)) W2(DRAM_AC26/--_/_BA1_/_BA1) Y1(DRAM_AC14/_--_/_A4_/_A4) Y2(DRAM_AC24/CK_t_B_/_A2_/_A2) Y3(DRAM_AC31/CA3_B_/_A0_/_A0); U3 AA14(ODT(ca)_A)* D1(VSF1)* D2(VSF3)* E1(VSF2)*

### Notes on the sheet
- (in symbol TitleBlock_MCPG) Nova34 - General Purpose Ultra Small Linux Board; Width: 34MM / Height: 30MM / Tickness: 1MM; Github: / Website: / Documentation:; Designer:; InnovativeBoards; Drawing Title:; NOVA34; Drawn by:; Page Title:; Rev; Approved:; Size; Document Number; Date:; Sheet; of

### Library data of the parts
R17-R19 = RC0201FR-07240RL: Resistor; Manufacturer_Name: KEMET; Datasheet Link: http://www.yageo.com/documents/recent/PYu-RC0201_51_RoHS_L_8.pdf; Height: 0.26mm; Manufacturer_Part_Number: RC0201FR-07240RL; Mouser Part Number: 603-RC0201FR-07240RL; Mouser Price/Stock: http://www.mouser.com/Search/ProductDetail.aspx?qs=qUsL5DZkYVqW175bPUdS2w%3d%3d; Arrow Part Number: RC0201FR-07240RL; Arrow Price/Stock: https://www.arrow.com/en/products/rc0201fr-07240rl/yageo
R20 = RC0402FR-0710KL: Resistor; Manufacturer_Name: KEMET; Datasheet Link: http://www.yageo.com/documents/recent/PYu-RC0402_51_RoHS_L_6_r.pdf; Height: 0.4mm; Manufacturer_Part_Number: RC0402FR-0710KL; Mouser Part Number: 603-RC0402FR-0710KL; Mouser Price/Stock: https://www.mouser.co.uk/ProductDetail/YAGEO/RC0402FR-0710KL?qs=I1mnnYJTTsxUoNwrUsQExA%3D%3D; Arrow Part Number: RC0402FR-0710KL; Arrow Price/Stock: https://www.arrow.com/en/products/rc0402fr-0710kl/yageo?region=europe
U1 = MIMX8MN: as U1 on sheet MX8M-Nano-USB; CLASS: IC; HEIGHT: 1.01MM; ROHS: Yes; MFG_PN01: MIMX8MN5CVPIZAA
*#4 = TitleBlock_MCPG: Page Create Date: March  8, 1995

## Sheet Wifi-MX8M.SchDoc
size B; SheetNumber: 9; SheetTotal: 15
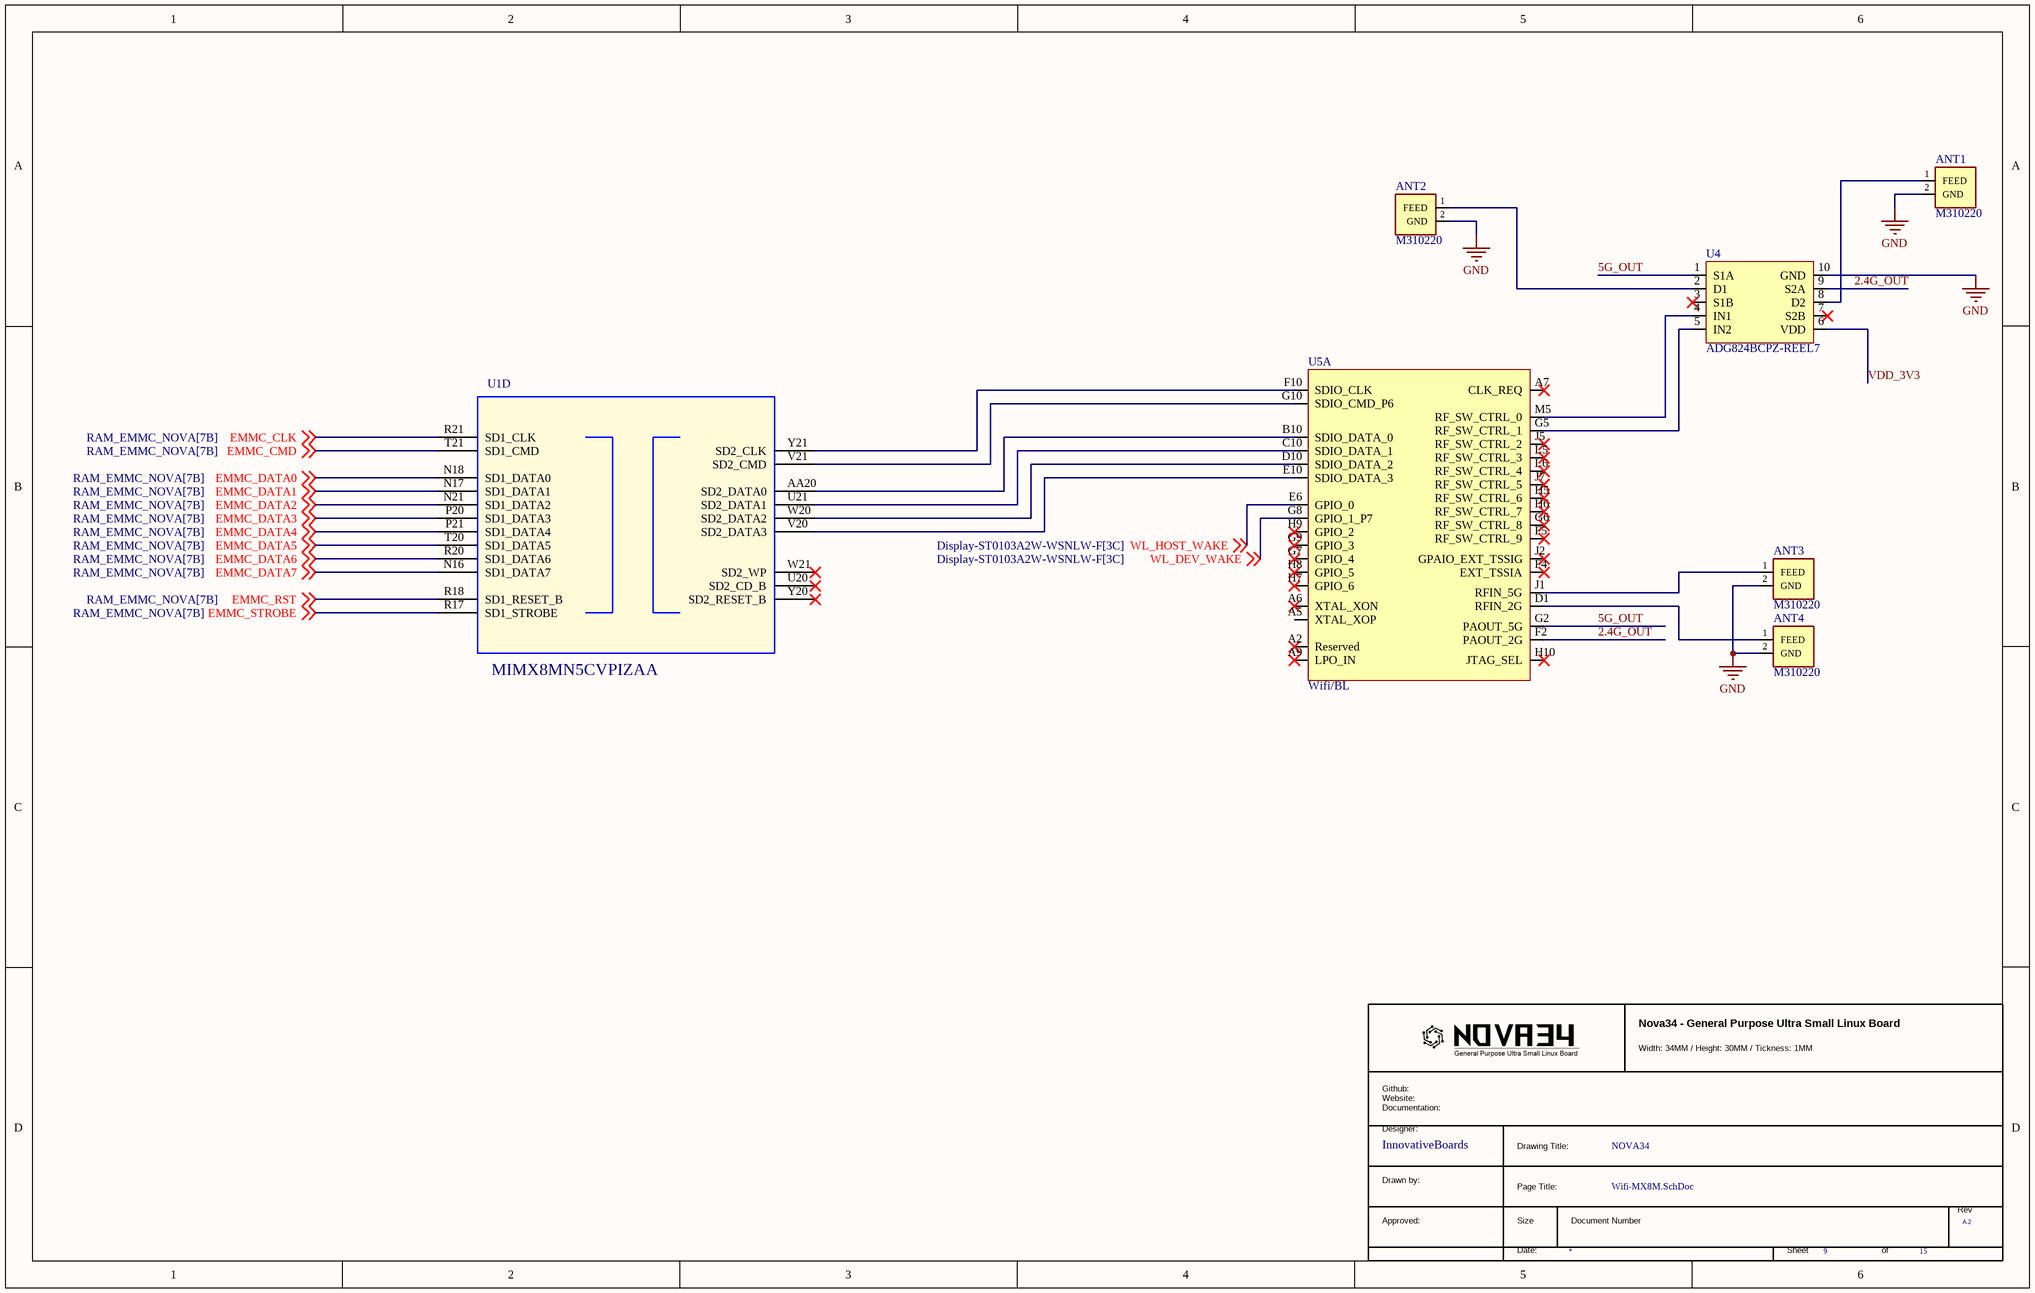
[diagram p5: Wifi-MX8M.SchDoc]

### Parts
(Parts that share a designator on the sheet are numbered #1, #2 ... from top to bottom, then left to right.)
*#5  RevCode: A.2  (hidden comment: TitleBlock_MCPG)  (graphical)
ANT1  M310220  [M310220]
ANT2  M310220  [M310220]
ANT3  M310220  [M310220]
ANT4  M310220  [M310220]
U1  MIMX8MN5CVPIZAA  [BGA306C50P21X21_1100X1100X101]  (part D of 12)
U4  ADG824BCPZ-REEL7  [ADG824]
U5  Wifi/BL  [106 BALL WLBGA 3.76X4.43X0.53 MM]  (part A of 3)

### Nets
GND: ANT1.2(GND) ANT2.2(GND) ANT3.2(GND) ANT4.2(GND) U4.10(GND)
2.4G_OUT: U4.9(S2A) U5.F2(PAOUT_2G)
5G_OUT: U4.1(S1A) U5.G2(PAOUT_5G)
EMMC_CLK: U1.R21(SD1_CLK) ; off-sheet EMMC_CLK
EMMC_CMD: U1.T21(SD1_CMD) ; off-sheet EMMC_CMD
EMMC_DATA0: U1.N18(SD1_DATA0) ; off-sheet EMMC_DATA0
EMMC_DATA1: U1.N17(SD1_DATA1) ; off-sheet EMMC_DATA1
EMMC_DATA2: U1.N21(SD1_DATA2) ; off-sheet EMMC_DATA2
EMMC_DATA3: U1.P20(SD1_DATA3) ; off-sheet EMMC_DATA3
EMMC_DATA4: U1.P21(SD1_DATA4) ; off-sheet EMMC_DATA4
EMMC_DATA5: U1.T20(SD1_DATA5) ; off-sheet EMMC_DATA5
EMMC_DATA6: U1.R20(SD1_DATA6) ; off-sheet EMMC_DATA6
EMMC_DATA7: U1.N16(SD1_DATA7) ; off-sheet EMMC_DATA7
EMMC_RST: U1.R18(SD1_RESET_B) ; off-sheet EMMC_RST
EMMC_STROBE: U1.R17(SD1_STROBE) ; off-sheet EMMC_STROBE
VDD_3V3: U4.6(VDD)
WL_DEV_WAKE: U5.G8(GPIO_1_P7) ; off-sheet WL_DEV_WAKE
WL_HOST_WAKE: U5.E6(GPIO_0) ; off-sheet WL_HOST_WAKE
NetANT1_1: ANT1.1(FEED) U4.8(D2)
NetANT2_1: ANT2.1(FEED) U4.2(D1)
NetANT3_1: ANT3.1(FEED) U5.J1(RFIN_5G)
NetANT4_1: ANT4.1(FEED) U5.D1(RFIN_2G)
NetU1_AA20: U1.AA20(SD2_DATA0) U5.B10(SDIO_DATA_0)
NetU1_U21: U1.U21(SD2_DATA1) U5.C10(SDIO_DATA_1)
NetU1_V20: U1.V20(SD2_DATA3) U5.E10(SDIO_DATA_3)
NetU1_V21: U1.V21(SD2_CMD) U5.G10(SDIO_CMD_P6)
NetU1_W20: U1.W20(SD2_DATA2) U5.D10(SDIO_DATA_2)
NetU1_Y21: U1.Y21(SD2_CLK) U5.F10(SDIO_CLK)
NetU4_4: U4.4(IN1) U5.M5(RF_SW_CTRL_0)
NetU4_5: U4.5(IN2) U5.G5(RF_SW_CTRL_1)

Not connected (* = marked no-connect by the designer): U1 U20(SD2_CD_B)* W21(SD2_WP)* Y20(SD2_RESET_B)*; U4 3(S1B)* 7(S2B)*; U5 A2(Reserved)* A5(XTAL_XOP) A6(XTAL_XON)* A7(CLK_REQ)* A9(LPO_IN)* F4(EXT_TSSIA)* F5(RF_SW_CTRL_9)* G6(RF_SW_CTRL_8)* G7(GPIO_4)* G9(GPIO_3)* H5(RF_SW_CTRL_6)* H6(RF_SW_CTRL_7)* H7(GPIO_6)* H8(GPIO_5)* H9(GPIO_2)* H10(JTAG_SEL)* J2(GPAIO_EXT_TSSIG)* J5(RF_SW_CTRL_2)* J7(RF_SW_CTRL_5)* L5(RF_SW_CTRL_3)* L6(RF_SW_CTRL_4)*

### Notes on the sheet
- (in symbol TitleBlock_MCPG) Nova34 - General Purpose Ultra Small Linux Board; Width: 34MM / Height: 30MM / Tickness: 1MM; Github: / Website: / Documentation:; Designer:; InnovativeBoards; Drawing Title:; NOVA34; Drawn by:; Page Title:; Rev; Approved:; Size; Document Number; Date:; Sheet; of

### Library data of the parts
ANT1-ANT4 = M310220: Antennas WiFi/BT Ceramic; Manufacturer_Name: Kyocera AVX; Datasheet Link: https://mouser.componentsearchengine.com/Datasheets/1/M310220.pdf; Height: 1.18mm; Manufacturer_Part_Number: M310220; Mouser Part Number: 581-M310220; Mouser Price/Stock: https://www.mouser.co.uk/ProductDetail/KYOCERA-AVX/M310220?qs=MLItCLRbWsySMY3y23wkRg%3D%3D; Arrow Part Number: M310220; Arrow Price/Stock: https://www.arrow.com/en/products/m310220/avx?utm_currency=USD&region=nac
U1 = MIMX8MN: as U1 on sheet MX8M-Nano-USB; CLASS: IC; HEIGHT: 1.01MM; ROHS: Yes; MFG_PN01: MIMX8MN5CVPIZAA
U4 = ADG824BCPZ-REEL7: IC SWITCH SPDTX2 800MOHM 10LFCSP; ComponentLink1Description: New link; ComponentLink1URL: https://www.digikey.com/en/products/detail/analog-devices-inc/ADG824BCPZ-REEL7/1956054
U5 = CYW43012
*#5 = TitleBlock_MCPG: Page Create Date: March  8, 1995

## Sheet Wifi-Bluetooth-Power.SchDoc
size A; SheetNumber: 11; SheetTotal: 15
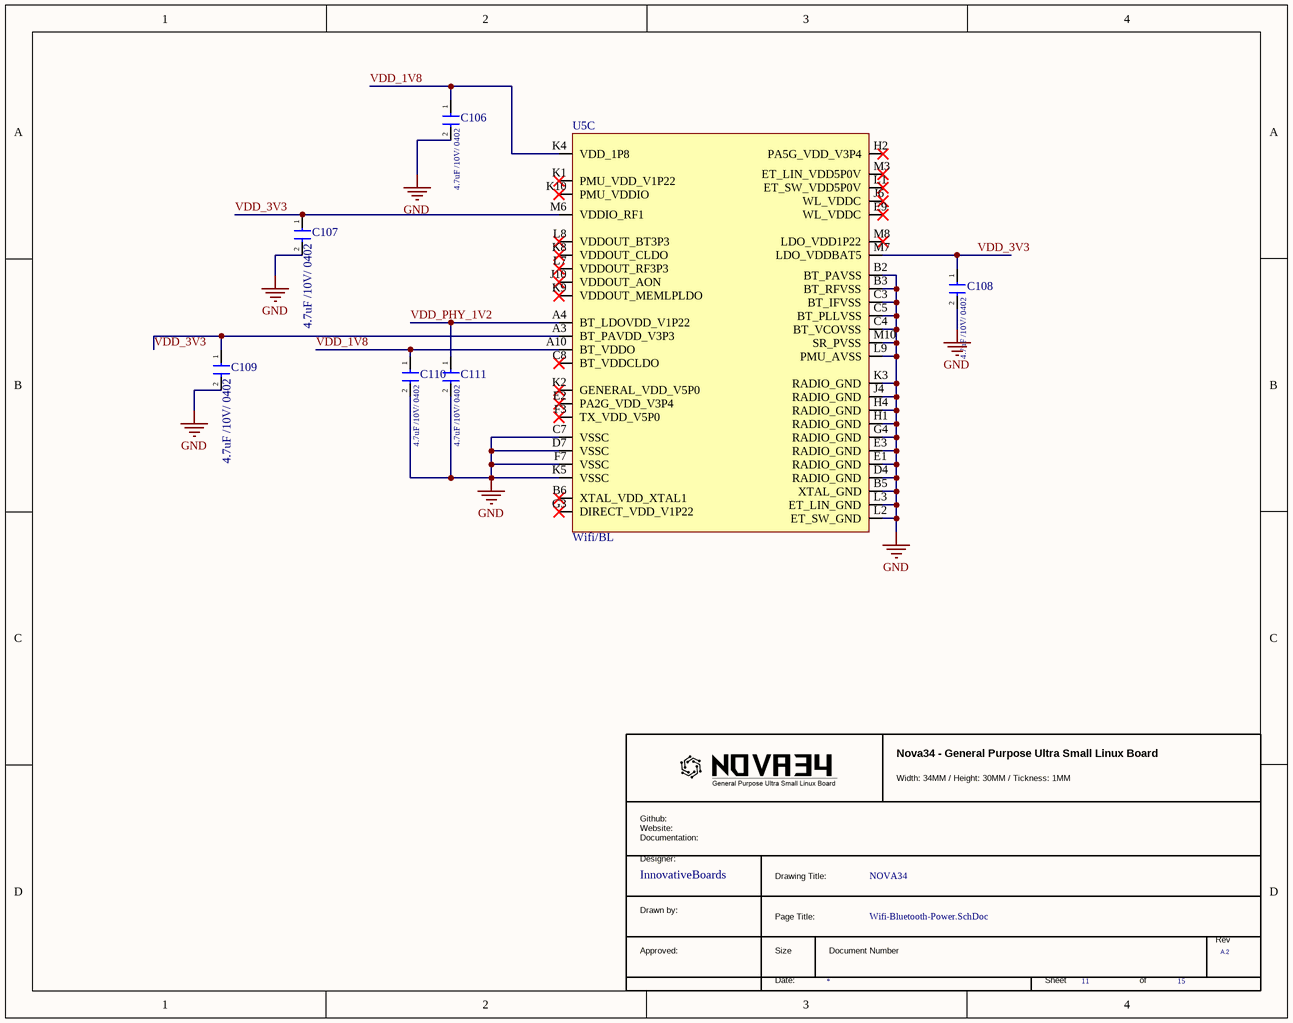
[diagram p6: Wifi-Bluetooth-Power.SchDoc]

### Parts
(Parts that share a designator on the sheet are numbered #1, #2 ... from top to bottom, then left to right.)
*#6  RevCode: A.2  (hidden comment: TitleBlock_MCPG)  (graphical)
C106  4.7uF /10V/ 0402  [CAPC1005X70N]
C107  4.7uF /10V/ 0402  [CAPC1005X70N]
C108  4.7uF /10V/ 0402  [CAPC1005X70N]
C109  4.7uF /10V/ 0402  [CAPC1005X70N]
C110  4.7uF /10V/ 0402  [CAPC1005X70N]
C111  4.7uF /10V/ 0402  [CAPC1005X70N]
U5  Wifi/BL  [106 BALL WLBGA 3.76X4.43X0.53 MM]  (part C of 3)

### Nets
GND: C106.2 C107.2 C108.2 C109.2 C110.2 C111.2 U5.B2(BT_PAVSS) U5.B3(BT_RFVSS) U5.B5(XTAL_GND) U5.C3(BT_IFVSS) U5.C4(BT_VCOVSS) U5.C5(BT_PLLVSS) U5.C7(VSSC) U5.D4(RADIO_GND) U5.D7(VSSC) U5.E1(RADIO_GND) U5.E3(RADIO_GND) U5.F7(VSSC) U5.G4(RADIO_GND) U5.H1(RADIO_GND) U5.H4(RADIO_GND) U5.J4(RADIO_GND) U5.K3(RADIO_GND) U5.K5(VSSC) U5.L2(ET_SW_GND) U5.L3(ET_LIN_GND) U5.L9(PMU_AVSS) U5.M10(SR_PVSS)
VDD_1V8: C106.1 C110.1 U5.A10(BT_VDDO) U5.K4(VDD_1P8)
VDD_3V3: C107.1 C108.1 C109.1 U5.A3(BT_PAVDD_V3P3) U5.M6(VDDIO_RF1) U5.M7(LDO_VDDBAT5)
VDD_PHY_1V2: C111.1 U5.A4(BT_LDOVDD_V1P22)

Not connected (* = marked no-connect by the designer): U5 B6(XTAL_VDD_XTAL1)* C8(BT_VDDCLDO)* E2(PA2G_VDD_V3P4)* E9(WL_VDDC)* F3(TX_VDD_V5P0)* G3(DIRECT_VDD_V1P22)* H2(PA5G_VDD_V3P4)* J6(WL_VDDC)* J10(VDDOUT_AON)* K1(PMU_VDD_V1P22)* K2(GENERAL_VDD_V5P0)* K8(VDDOUT_CLDO)* K9(VDDOUT_MEMLPLDO)* K10(PMU_VDDIO)* L1(ET_SW_VDD5P0V)* L7(VDDOUT_RF3P3)* L8(VDDOUT_BT3P3)* M3(ET_LIN_VDD5P0V)* M8(LDO_VDD1P22)*

### Notes on the sheet
- (in symbol TitleBlock_MCPG) Nova34 - General Purpose Ultra Small Linux Board; Width: 34MM / Height: 30MM / Tickness: 1MM; Github: / Website: / Documentation:; Designer:; InnovativeBoards; Drawing Title:; NOVA34; Drawn by:; Page Title:; Rev; Approved:; Size; Document Number; Date:; Sheet; of

### Library data of the parts
C106-C111 = GRT155C81A475ME13J: as C58 on sheet PMIC-MX8M; Datasheet Link: https://search.murata.co.jp/Ceramy/image/img/A01X/G101/ENG/GRT155C81A475ME13-01A.pdf; Height: 0.7mm; Manufacturer_Part_Number: GRT155C81A475ME13J; Mouser Part Number: 81-GRT155C81A475ME3J; Mouser Price/Stock: https://www.mouser.co.uk/ProductDetail/Murata-Electronics/GRT155C81A475ME13J?qs=ufv2HEpFn%252BS%252BPUDm1eQCHw%3D%3D
U5 = CYW43012
*#6 = TitleBlock_MCPG: Page Create Date: March  8, 1995

## Nets that join several sheets
GND: MX8M-Nano-USB (R7.2), PMIC-MX8M (30 pins), RAM_EMMC_NOVA (R19.2 R20.2), Wifi-MX8M (5 pins), Wifi-Bluetooth-Power (28 pins)
EMMC_CLK: RAM_EMMC_NOVA (U3.A10), Wifi-MX8M (U1.R21)
EMMC_CMD: RAM_EMMC_NOVA (U3.B17), Wifi-MX8M (U1.T21)
EMMC_DATA0: RAM_EMMC_NOVA (U3.A9), Wifi-MX8M (U1.N18)
EMMC_DATA1: RAM_EMMC_NOVA (U3.B7), Wifi-MX8M (U1.N17)
EMMC_DATA2: RAM_EMMC_NOVA (U3.B12), Wifi-MX8M (U1.N21)
EMMC_DATA3: RAM_EMMC_NOVA (U3.B13), Wifi-MX8M (U1.P20)
EMMC_DATA4: RAM_EMMC_NOVA (U3.B8), Wifi-MX8M (U1.P21)
EMMC_DATA5: RAM_EMMC_NOVA (U3.A7), Wifi-MX8M (U1.T20)
EMMC_DATA6: RAM_EMMC_NOVA (U3.A12), Wifi-MX8M (U1.R20)
EMMC_DATA7: RAM_EMMC_NOVA (U3.A14), Wifi-MX8M (U1.N16)
EMMC_RST: RAM_EMMC_NOVA (U3.A17), Wifi-MX8M (U1.R18)
EMMC_STROBE: RAM_EMMC_NOVA (U3.B15), Wifi-MX8M (U1.R17)
VDD_1V8: PMIC-MX8M (C63.1 L5.2 U2.14), Wifi-Bluetooth-Power (C106.1 C110.1 U5.A10 U5.K4)
VDD_3V3: PMIC-MX8M (C60.1 L4.2 U2.21), Wifi-MX8M (U4.6), Wifi-Bluetooth-Power (6 pins)
VDD_PHY_1V2: PMIC-MX8M (C72.1 U2.1), Wifi-Bluetooth-Power (C111.1 U5.A4)